# Altium project DC_Pump_Soft_Starter.PrjPcb
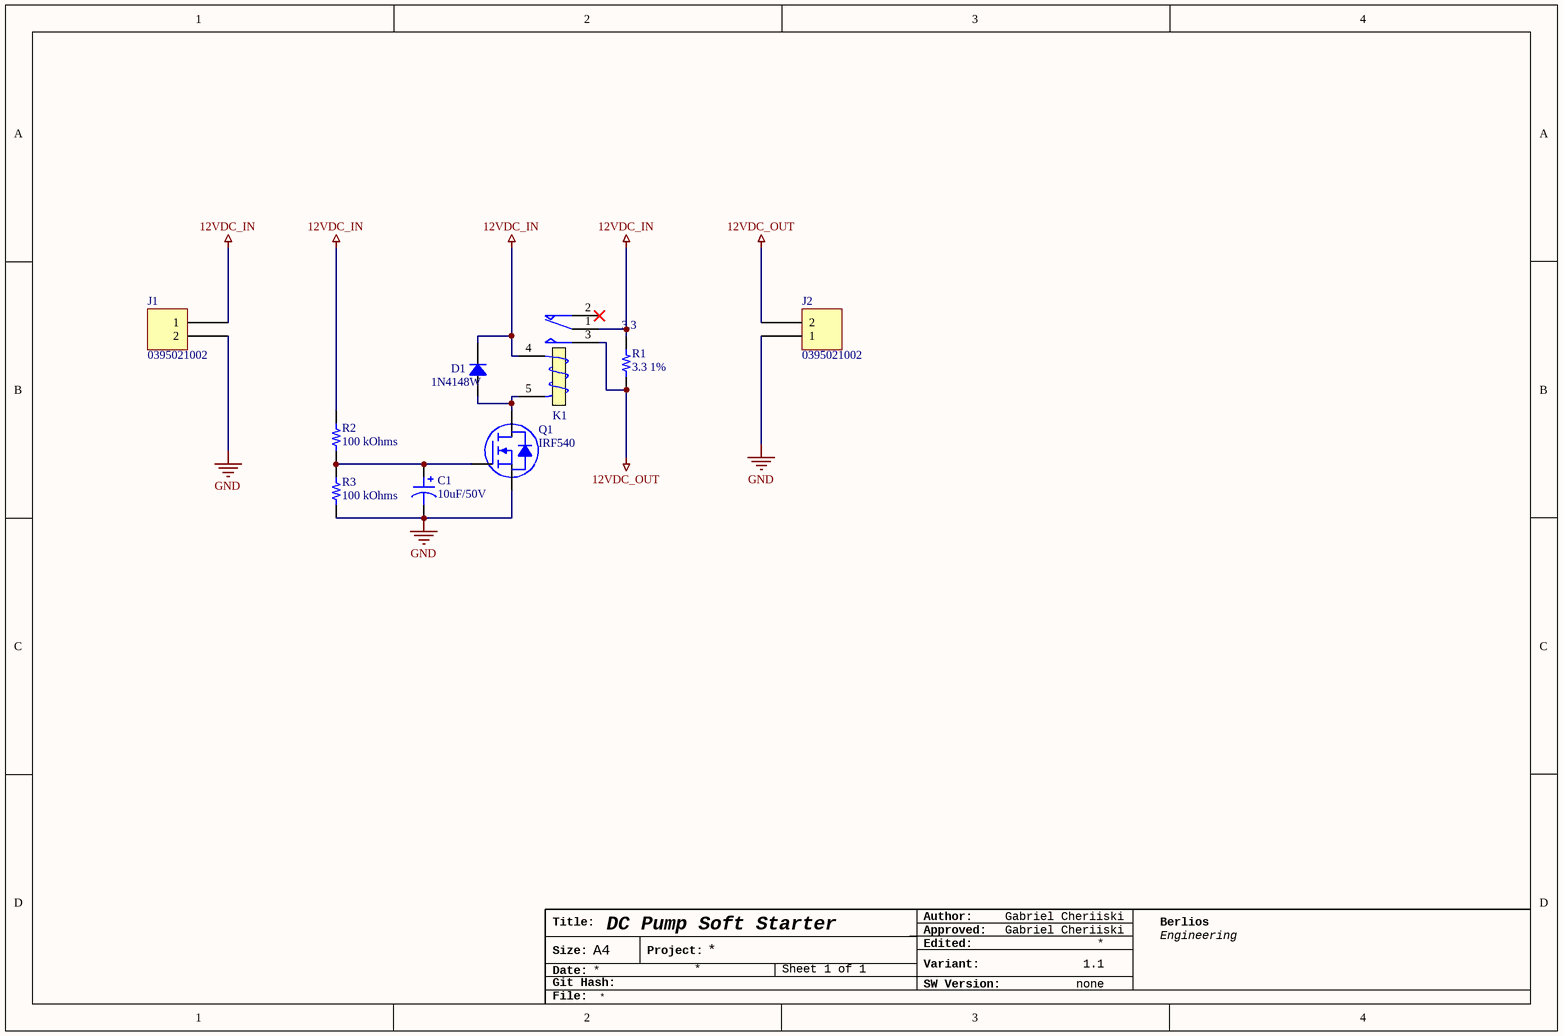
[diagram p0: DC_Pump_Soft_Starter.SchDoc]
1 sheet, 9 parts. Net scope: global (net labels, ports and power ports of the same name join across sheets).
Board file: DC_Pump_Soft_Starter.PcbDoc

## Sheet DC_Pump_Soft_Starter.SchDoc
size A4; ApprovedBy: Stanislav Vodolagin; Author: Stanislav Vodolagin; CompanyName: Stason Corp; Organization: Stason Corp; Address1: Riga; Address2: Latvia; SheetNumber: 1; SheetTotal: 1

### Parts
C1  10uF/50V  [CAP TH ALUM ELEC D6.30mm S2.50mm H8.00mm]
D1  1N4148W  [SOD123F]
J1  0395021002  [MOLEX 395021002]
J2  0395021002  [MOLEX 395021002]
K1  Relay 5pin Mini Milon 12V  [REL_MILON_MINI]  (value not drawn)
Q1  IRF540  [TO-220-3]
R1  3.3 1%  value 3.3  [RES TH 2W AXIAL-0.8]
R2  100 kOhms  [RES 0805_2012]
R3  100 kOhms  [RES 0805_2012]

### Nets
12VDC_IN: D1.2 J1.1 K1.1(COM) K1.4(T1) R1.1 R2.2
12VDC_OUT: J2.2 K1.3(NO) R1.2
GND: C1.2 J1.2 J2.1 Q1.3(S) R3.1
NetC1_1: C1.1 Q1.1(G) R2.1 R3.2
NetD1_1: D1.1 K1.5(T2) Q1.2(D)

Not connected (* = marked no-connect by the designer): K1 2(NC)*

### Notes on the sheet
- Title:
- DC Pump Soft Starter
- Author:
- Approved:
- Gabriel Cheriiski
- Berlios
- Size:
- Date:
- Git Hash:
- A4
- Project:
- SW Version:
- Variant:
- Edited:
- none
- 1.1
- Engineering
- File:

### Library data of the parts
C1 = 106RSS050M: CAP ALUM 10UF 20% 50V THRU HOLE; manufacturer: Illinois Capacitor; Capacitance: 10µF; ESR (Equivalent Series Resistance): 16.579Ohm @ 120Hz; Lifetime @ Temp.: 1000 Hrs @ 85°C; Polarization: Polar; Ripple Current @ High Frequency: 70mA @ 100kHz; Ripple Current @ Low Frequency: 50mA @ 120Hz; value: 10µF; Part Number: 106RSS050M; Applications: General Purpose; componentlink1description: Datasheet; componentlink1url: http://www.illinoiscapacitor.com/pdf/seriesDocuments/RSS%20series.pdf; componentlink2description: DigiKey Link; componentlink2url: http://digikey.com/product-detail/en/illinois-capacitor/106RSS050M/1572-1291-ND/5410679; Device Package: Radial, Can; Height - Seated (Max): 0.315" (8.00mm); lastupdated: 4.9.2020 г. 23:28:56; Lead Spacing: 0.098" (2.50mm); Lifecycle Status: Active; Minimum Order: 1; Mounting Type: Through Hole; Operating Temperature: -40°C ~ 85°C; Package / Case: Radial, Can; packaging: Bulk; partid: 21108; Part Status: Active; price: 0.31; series: RSS; Size / Dimension: 0.248" Dia (6.30mm); Supplier 1: DigiKey; Supplier Part Number 1: 1572-1291-ND; Tolerance: ±20%; Voltage - Rated: 50V
D1 = 1N4007FLTR: SOD-123 SMD; Manufacturer: SMC Diode Solutions; Capacitance @ Vr, F: 15pF @ 4V, 1MHz; Current - Average Rectified (Io): 1A; Current - Reverse Leakage @ Vr: 5µA @ 1000V; Diode Type: Standard; Speed: Standard Recovery >500ns, > 200mA (Io); Voltage - DC Reverse (Vr) (Max): 1000V; Voltage - Forward (Vf) (Max) @ If: 1.1V @ 1A; Part Number: 1N4148W; ComponentLink1Description: Datasheet; ComponentLink1URL: http://www.smc-diodes.com/propdf/1N4001FL-1N4007FL%20N1646%20REV.A.pdf; ComponentLink2Description: DigiKey Link; ComponentLink2URL: http://digikey.com/product-detail/en/smc-diode-solutions/1N4007FLTR/1655-1N4007FLCT-ND/11657827; LastUpdated: 30.8.2020 г. 20:59:55; Lifecycle Status: Active; Minimum Order: 1; Mounting Type: Surface Mount; Package / Case: SOD-123F; Packaging: TapeAndReel; PartId: 3314; Price: 0.01; Supplier 1: DigiKey; Supplier Part Number 1: 1655-1N4007FLCT-ND; Supplier Device Package: SOD-123FL
J1 J2 = 0395021002: TERM BLOCK HDR 2POS 90DEG 3.5MM; Manufacturer: Molex; Current - UL: 8A; Header Orientation: 90°, Right Angle; Number of Levels: 1; Number of Positions: 2; Pitch: 0.138" (3.50mm); Voltage - UL: 300V; Part Number: 0395021002; Color: Black; ComponentLink1Description: Datasheet; ComponentLink1URL: https://www.molex.com/pdm_docs/sd/395021002_sd.pdf; ComponentLink2Description: DigiKey Link; ComponentLink2URL: http://digikey.com/product-detail/en/molex/0395021002/WM7770-ND/1280621; Contact Mating Finish: Tin; LastUpdated: 25.6.2020 г. 15:44:05; Lifecycle Status: Active; Minimum Order: 1; Mounting Type: Through Hole; Operating Temperature: -40°C ~ 105°C; Packaging: Tray; Part Status: Active; Positions Per Level: 2; Price: 0.58; Series: Eurostyle ESE 39502; Supplier 1: DigiKey; Supplier Part Number 1: WM7770-ND; Termination Style: Solder; Type: Header, Male Pins, Shrouded (4 Side)
K1 = Relay 5pin Mini Milon 12V: TRKM S-Z L 12VDC; PartNumber: TRKM S-Z L12VDC; ComponentLink1Description: https://www.aliexpress.com/item/1005004478770960.html?spm=a2g0o.order_list.order_list_main.5.56c11802IdLJ6g; ComponentLink1URL: *
Q1 = IRFZ44 (THD): N-Channel 100V 33A (Tc) 94W (Tc) Through Hole TO-220AB; PartNumber: IRF540
R1 = Res TH 2W AXIAL-0.8: TH Resistor
R2 R3 = CHP0805AFX-1003ELF: RESHIGHPOWERA 0805 100K 1% 1/2W; Manufacturer: Bourns Inc.; Power (Watts): 0.5W, 1/2W; Temperature Coefficient: ±100ppm/°C; Part Number: CHP0805AFX-1003ELF; Value: 100 kOhms; ComponentLink1Description: Datasheet; ComponentLink1URL: https://www.bourns.com/docs/product-datasheets/chp-a.pdf; ComponentLink2Description: DigiKey Link; ComponentLink2URL: https://www.digikey.com/en/products/detail/bourns-inc/CHP0805AFX-1003ELF/12144391; Composition: Thick Film; Device Package: 0805 (2012 Metric); Features: Anti-Sulfur, Automotive AEC-Q200, Moisture Resistant, Pulse Withstanding; Height - Seated (Max): 0.024" (0.60mm); LastUpdated: 24.11.2023 г. 21:00:30; Lifecycle Status: Active; Minimum Order: 1; Number of Terminations: 2; Operating Temperature: -55°C ~ 155°C; Package / Case: 0805 (2012 Metric); Packaging: TapeAndReel; PartId: 61757; Part Status: Active; Price: 0.06; Ratings: AEC-Q200; Resistance: 100 kOhms; Series: CHP-A; Size / Dimension: 0.079" L x 0.049" W (2.00mm x 1.25mm); Supplier 1: DigiKey; Supplier Part Number 1: 118-CHP0805AFX-1003ELFCT-ND; Supplier Device Package: 0805; Tolerance: ±1%